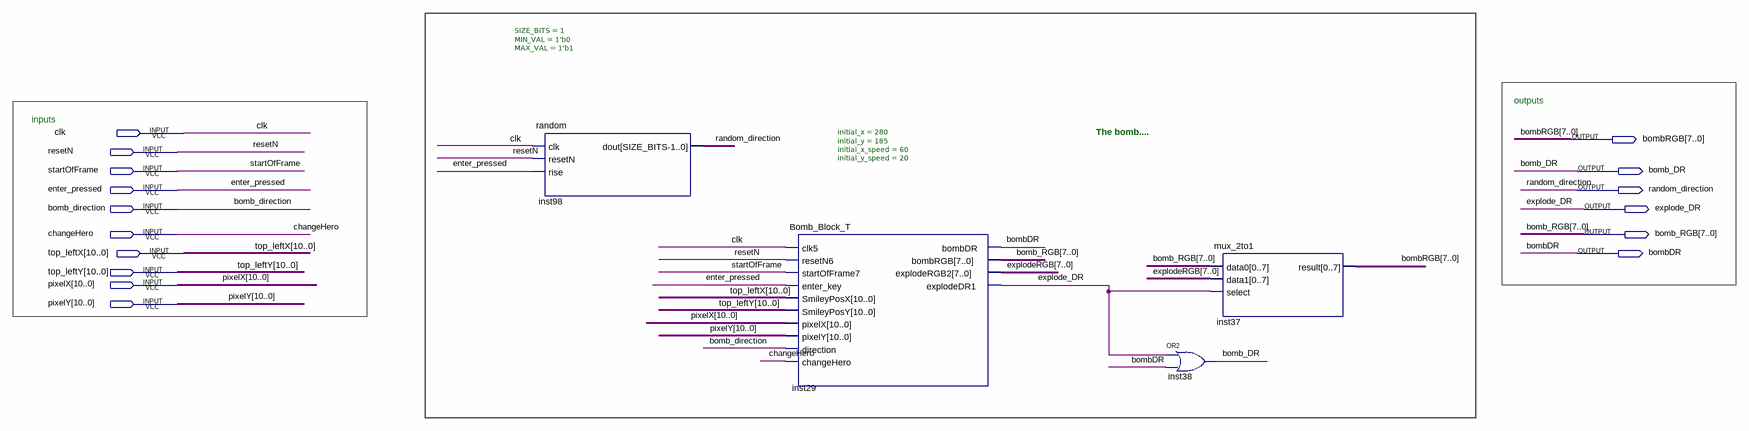
[diagram p0: schematic sheet]
// Quartus schematic topBomb_V2.bdf as structural Verilog: 4 symbols, 16 pins
module topBomb_V2 (
  input  clk,
  input  resetN,
  input  startOfFrame,
  input  enter_pressed,
  input  bomb_direction,
  input  changeHero,
  input  [10:0] top_leftX,
  input  [10:0] top_leftY,
  input  [10:0] pixelX,
  input  [10:0] pixelY,
  output [7:0] bombRGB,
  output bomb_DR,
  output random_direction,
  output explode_DR,
  output [7:0] bomb_RGB,
  output bombDR
);

  wire [7:0] explodeRGB;

  random #(.SIZE_BITS(1), .MIN_VAL(1'b0), .MAX_VAL(1'b1)) inst98 (
    .clk(clk), .resetN(resetN), .rise(enter_pressed), .dout(random_direction));
  Bomb_Block_T #(.initial_x(280), .initial_y(185), .initial_x_speed(60), .initial_y_speed(20)) inst29 (
    .clk5(clk), .resetN6(resetN), .startOfFrame7(startOfFrame), .enter_key(enter_pressed),
    .SmileyPosX(top_leftX), .SmileyPosY(top_leftY), .pixelX(pixelX), .pixelY(pixelY),
    .direction(bomb_direction), .changeHero(changeHero), .bombDR(bombDR), .bombRGB(bomb_RGB),
    .explodeRGB2(explodeRGB), .explodeDR1(explode_DR));
  or inst38 (bomb_DR, explode_DR, bombDR);
  mux_2to1 inst37 (.data0(bomb_RGB), .data1(explodeRGB), .select(explode_DR), .result(bombRGB));

  // Notes on the sheet:
  //   outputs
  //   inputs
  //   The bomb....
endmodule
